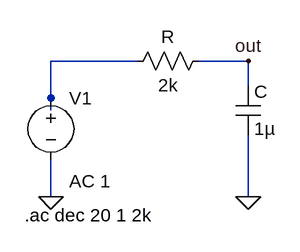
[diagram p0: schematic 3.Low Pass FIlter.asc]
3.Low Pass FIlter.asc, the LTspice schematic file:
Version 4
SHEET 1 880 680
WIRE 160 32 48 32
WIRE 304 32 240 32
WIRE 304 64 304 32
WIRE 48 80 48 32
WIRE 48 96 48 80
WIRE 48 208 48 160
WIRE 304 208 304 128
FLAG 48 208 0
FLAG 304 208 0
FLAG 304 32 out
SYMBOL voltage 48 64 R0
WINDOW 123 24 124 Left 2
WINDOW 39 0 0 Left 0
SYMATTR InstName V1
SYMATTR Value ""
SYMATTR Value2 AC 1
SYMBOL res 256 16 R90
WINDOW 0 0 56 VBottom 2
WINDOW 3 32 56 VTop 2
SYMATTR InstName R
SYMATTR Value 2k
SYMBOL cap 288 64 R0
SYMATTR InstName C
SYMATTR Value 1µ
TEXT 14 232 Left 2 !.ac dec 20 1 2k

The netlist it stands for:
* 3.Low Pass FIlter.asc
V1 N001 0 AC 1
R out N001 2k
C out 0 1µ
.ac dec 20 1 2k
.backanno
.end